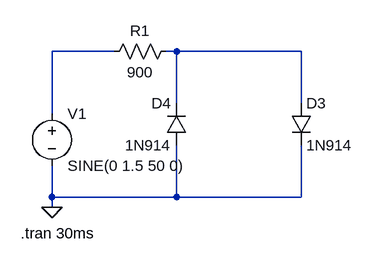
[diagram p0: schematic limiter.asc]
limiter.asc, the LTspice schematic file:
Version 4
SHEET 1 1140 680
WIRE 16 64 -80 64
WIRE 112 64 96 64
WIRE 304 64 112 64
WIRE 112 144 112 64
WIRE 304 144 304 64
WIRE -80 160 -80 64
WIRE -80 288 -80 240
WIRE 112 288 112 208
WIRE 112 288 -80 288
WIRE 304 288 304 208
WIRE 304 288 112 288
WIRE -80 304 -80 288
FLAG -80 304 0
SYMBOL voltage -80 144 R0
WINDOW 123 0 0 Left 2
WINDOW 39 0 0 Left 2
SYMATTR InstName V1
SYMATTR Value SINE(0 1.5 50 0)
SYMBOL diode 288 144 R0
SYMATTR InstName D3
SYMATTR Value 1N914
SYMBOL diode 128 208 R180
WINDOW 0 24 64 Left 2
WINDOW 3 24 0 Left 2
SYMATTR InstName D4
SYMATTR Value 1N914
SYMBOL res 112 48 R90
WINDOW 0 0 56 VBottom 2
WINDOW 3 32 56 VTop 2
SYMATTR InstName R1
SYMATTR Value 900
TEXT -128 344 Left 2 !.tran 30ms

The netlist it stands for:
* limiter.asc
V1 N001 0 SINE(0 1.5 50 0)
D3 N002 0 1N914
D4 0 N002 1N914
R1 N002 N001 900
.model D D
.lib standard.dio
.tran 30ms
.backanno
.end